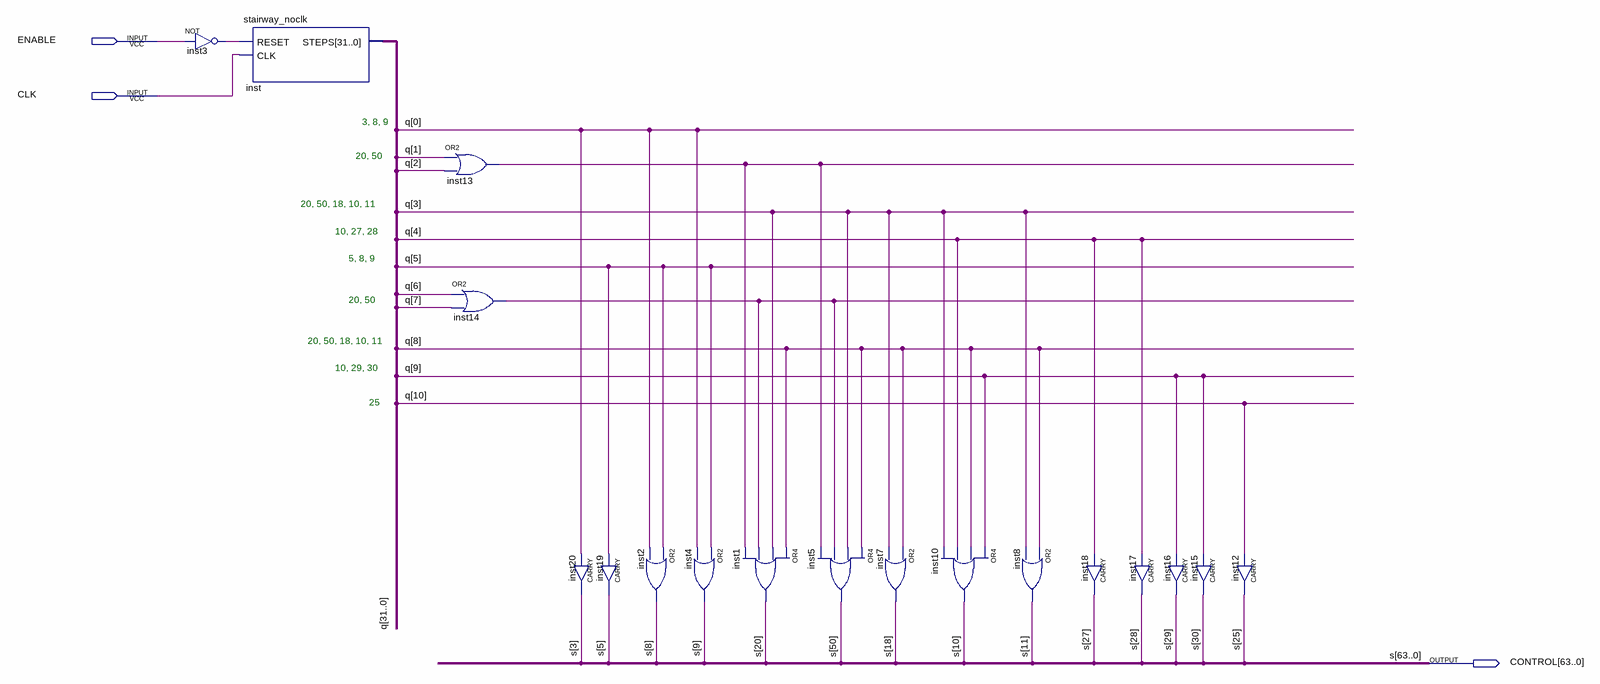
[diagram p0: schematic sheet]
// Quartus schematic macro_direct.bdf as structural Verilog: 18 symbols, 3 pins
module macro_direct (
  input  ENABLE,
  input  CLK,
  output [63:0] CONTROL
);

  wire inst3_out, inst13_out, inst14_out;
  wire [31:0] q;

  not inst3 (inst3_out, ENABLE);
  stairway_noclk inst (.RESET(inst3_out), .CLK(CLK), .STEPS(q));
  or inst13 (inst13_out, q[1], q[2]);
  or inst14 (inst14_out, q[6], q[7]);
  CARRY inst19 (.IN(q[5]), .OUT(CONTROL[5]));
  CARRY inst20 (.IN(q[0]), .OUT(CONTROL[3]));
  or inst2 (CONTROL[8], q[5], q[0]);
  or inst4 (CONTROL[9], q[5], q[0]);
  or inst1 (CONTROL[20], q[8], q[3], inst14_out, inst13_out);
  or inst5 (CONTROL[50], q[8], q[3], inst14_out, inst13_out);
  or inst7 (CONTROL[18], q[8], q[3]);
  or inst10 (CONTROL[10], q[9], q[8], q[4], q[3]);
  or inst8 (CONTROL[11], q[8], q[3]);
  CARRY inst18 (.IN(q[4]), .OUT(CONTROL[27]));
  CARRY inst17 (.IN(q[4]), .OUT(CONTROL[28]));
  CARRY inst15 (.IN(q[9]), .OUT(CONTROL[30]));
  CARRY inst16 (.IN(q[9]), .OUT(CONTROL[29]));
  CARRY inst12 (.IN(q[10]), .OUT(CONTROL[25]));

  // Other names for the same wires on the sheet: s[63:0] = CONTROL

  // Notes on the sheet:
  //   3, 8, 9
  //   20, 50
  //   20, 50, 18, 10, 11
  //   10, 27, 28
  //   5, 8, 9
  //   20, 50
  //   20, 50, 18, 10, 11
  //   10, 29, 30
  //   25
endmodule
